# EAGLE design Opener (EAGLE 7.1.0)
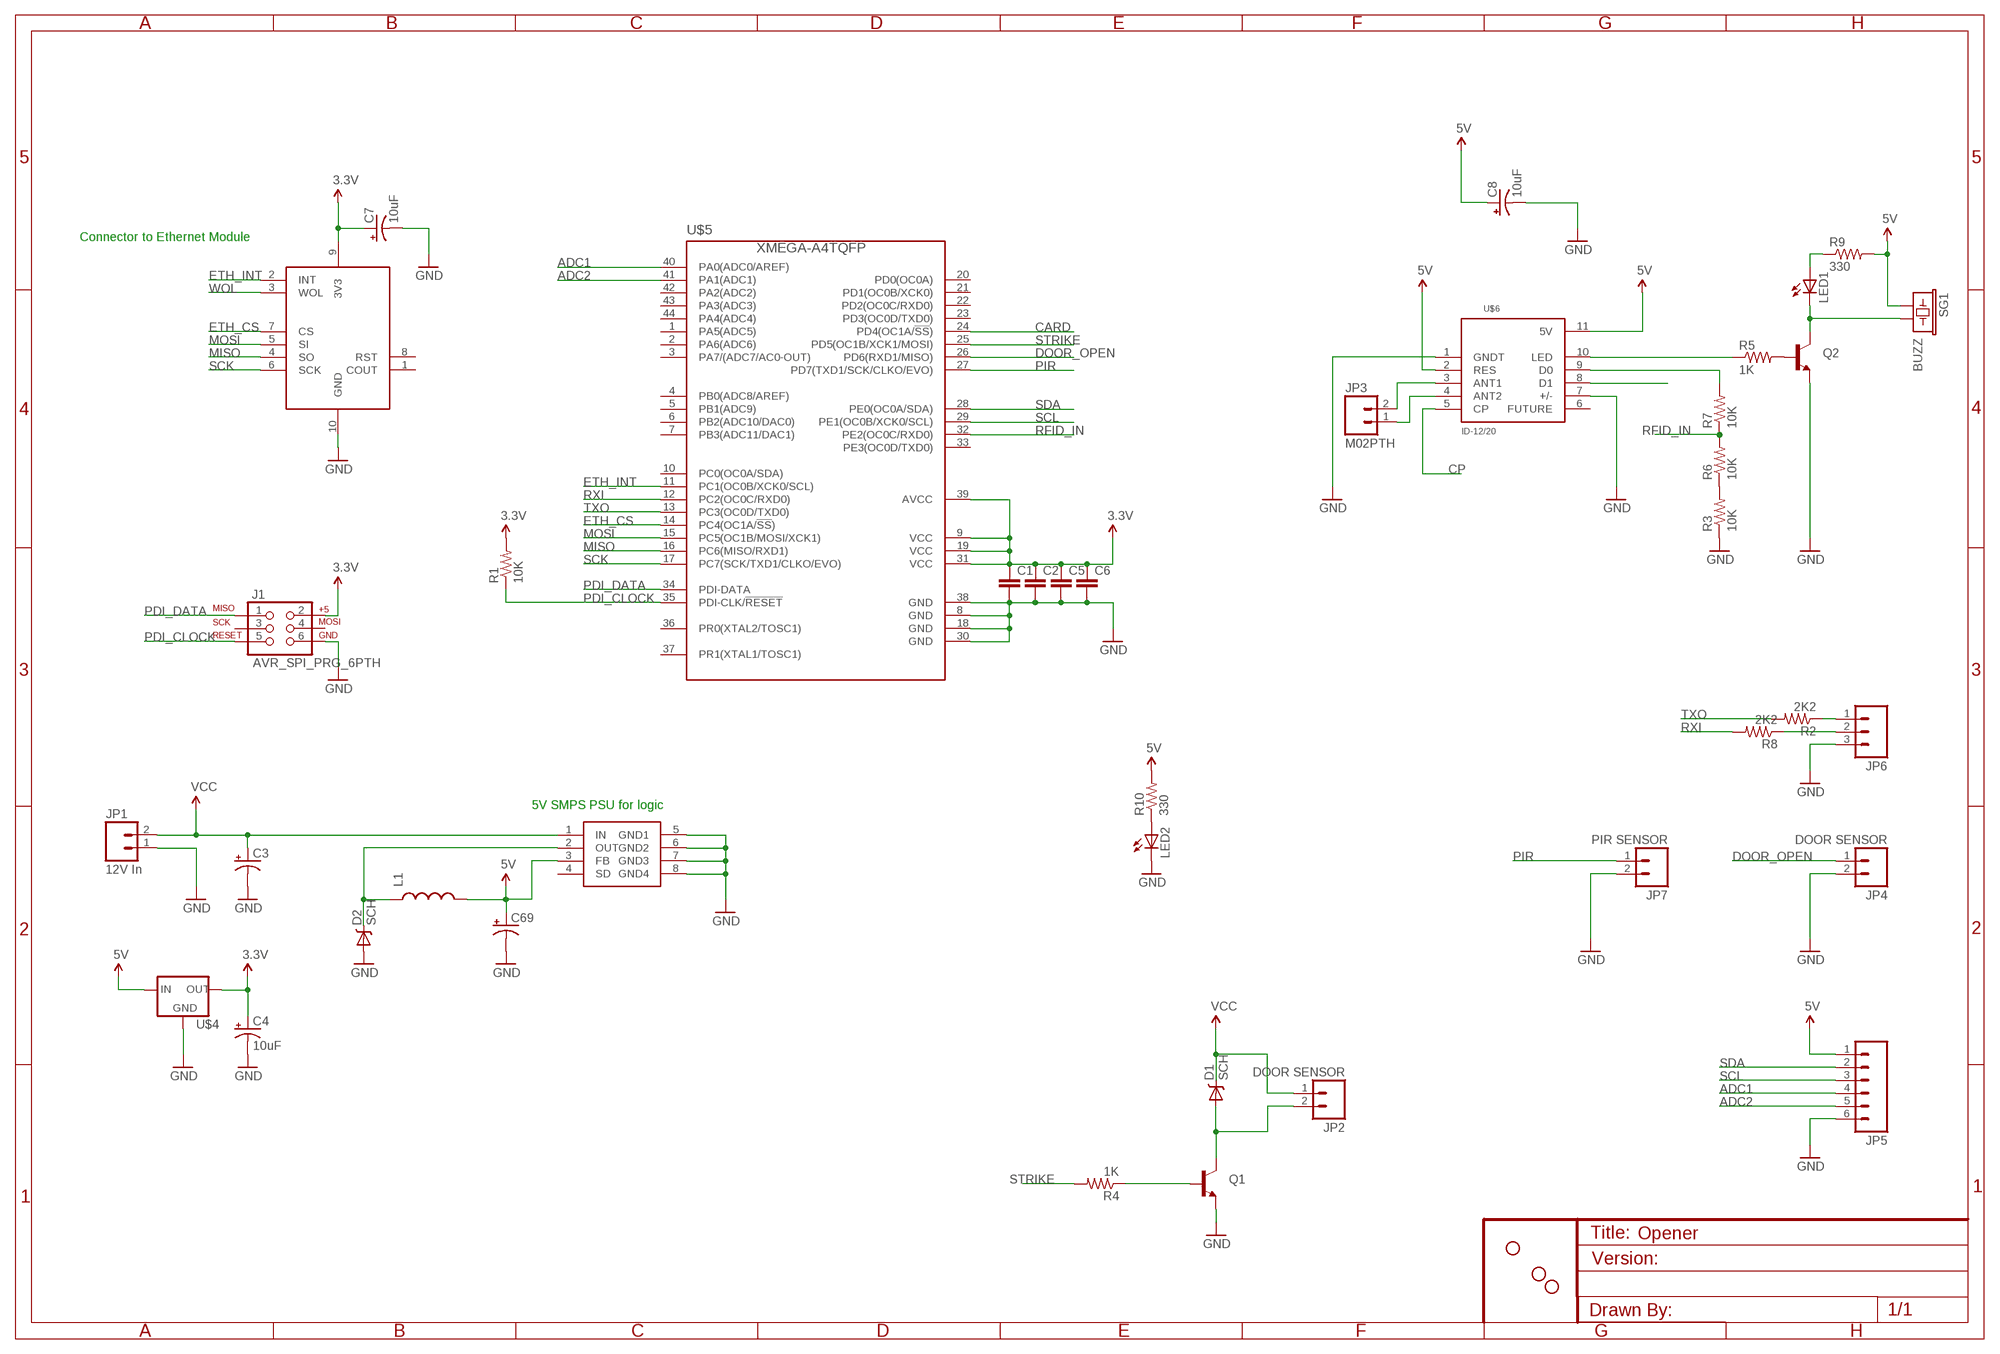
[diagram p0: schematic, sheet 1]

## Parts
C1  CAP0603-CAP  [0603-CAP]
C2  CAP0603-CAP  [0603-CAP]
C3  CAP_POLPTH1  [CPOL-RADIAL-100UF-25V]
C4  10uF  CAP_POL1206  [EIA3216]
C5  CAP0603-CAP  [0603-CAP]
C6  CAP0603-CAP  [0603-CAP]
C7  10uF  CAP_POL1206  [EIA3216]
C8  10uF  CAP_POL1206  [EIA3216]
C69  CAP_POLPTH1  [CPOL-RADIAL-100UF-25V]
D1  SCH  DIODE-SCHOTTKY_  [SMA-DIODE]
D2  SCH  DIODE-SCHOTTKY_  [SMA-DIODE]
J1  AVR_SPI_PRG_6PTH  [2X3]
JP1  12V In  M023.5MM  [SCREWTERMINAL-3.5MM-2]
JP2  DOOR SENSOR  M02POLAR  [MOLEX-1X2]
JP3  M02PTH  [1X02]
JP4  DOOR SENSOR  M02POLAR  [MOLEX-1X2]
JP5  M06SIP  [1X06]
JP6  M03PTH  [1X03]
JP7  PIR SENSOR  M02POLAR  [MOLEX-1X2]
L1  INDUCTOR1206H*  [INDUCTOR-1206]
LED1  LED-FKIT-1206  [FKIT-LED-1206]
LED2  LED-FKIT-1206  [FKIT-LED-1206]
Q1  TRANSISTOR_NPNTO92  [TO-92]
Q2  TRANSISTOR_NPNSOT23  [SOT23]
R1  10K  RESISTOR1206  [1206]
R2  2K2  RESISTOR1206  [1206]
R3  10K  RESISTOR1206  [1206]
R4  1K  RESISTOR1206  [1206]
R5  1K  RESISTOR1206  [1206]
R6  10K  RESISTOR1206  [1206]
R7  10K  RESISTOR1206  [1206]
R8  2K2  RESISTOR1206  [1206]
R9  330  RESISTOR1206  [1206]
R10  330  RESISTOR1206  [1206]
SG1  BUZZ  BUZZERSMD2  [BUZZER-CCV]
STANDOFF1  STAND-OFF  [STAND-OFF]
STANDOFF3  STAND-OFF  [STAND-OFF]
STANDOFF4  STAND-OFF  [STAND-OFF]
U$1  ETHMODULE  [2X5]
U$3  AP1509-33  [SOIC-8]
U$4  V_REG_MIC2920  [SOT223]
U$5  XMEGA-A4TQFP  [TQFP44]
U$6  ID-12/20  [ID-12]

## Nets
3.3V: C1.1 C2.1 C4.A(+) C5.1 C6.1 C7.A(+) J1.2 R1.2 U$1.9(3V3) U$4.3(OUT) U$5.9(VCC) U$5.19(VCC) U$5.31(VCC) U$5.39(AVCC)
5V: C8.A(+) C69.1(+) JP5.1 L1.P$2 R9.2 R10.2 SG1.+ U$3.3(FB) U$4.1(IN) U$6.2(RES) U$6.11(5V)
ADC1: JP5.4 U$5.40(PA0(ADC0/AREF))
ADC2: JP5.5 U$5.41(PA1(ADC1))
CARD: U$5.24(PD4(OC1A/!SS!))
CP: U$6.5(CP)
DOOR_OPEN: JP4.1 U$5.26(PD6(RXD1/MISO))
ETH_CS: U$1.7(CS) U$5.14(PC4(OC1A/!SS!))
ETH_INT: U$1.2(INT) U$5.11(PC1(OC0B/XCK0/SCL))
GND: C1.2 C2.2 C3.2(-) C4.C(-) C5.2 C6.2 C7.C(-) C8.C(-) C69.2(-) D2.A J1.6 JP1.1 JP4.2 JP5.6 JP6.3 JP7.2 LED2.C Q1.1(E) Q2.2(E) R3.1 U$1.10(GND) U$3.5(GND1) U$3.6(GND2) U$3.7(GND3) U$3.8(GND4) U$4.2(GND) U$5.8(GND) U$5.18(GND) U$5.30(GND) U$5.38(GND) U$6.1(GNDT) U$6.7(+/-)
MISO: U$1.4(SO) U$5.16(PC6(MISO/RXD1))
MOSI: U$1.5(SI) U$5.15(PC5(OC1B/MOSI/XCK1))
N$1: Q1.2(B) R4.1
N$2: JP3.2 U$6.3(ANT1)
N$3: D2.C L1.P$1 U$3.2(OUT)
N$4: R7.2 U$6.9(D0)
N$5: R3.2 R6.1
N$6: JP3.1 U$6.4(ANT2)
N$7: D1.A JP2.2 Q1.3(C)
N$8: R5.1 U$6.10(LED)
N$9: Q2.1(B) R5.2
N$10: LED1.C Q2.3(C) SG1.-
N$11: LED1.A R9.1
N$12: JP6.1 R2.1
N$13: U$6.8(D1)
N$14: LED2.A R10.1
N$17: JP6.2 R8.1
PDI_CLOCK: J1.5 R1.1 U$5.35(PDI-CLK/!RESET)
PDI_DATA: J1.1 U$5.34(PDI-DATA)
PIR: JP7.1 U$5.27(PD7(TXD1/SCK/CLKO/EVO))
RFID_IN: R6.2 R7.1 U$5.32(PE2(OC0C/RXD0))
RXI: R8.2 U$5.12(PC2(OC0C/RXD0))
SCK: U$1.6(SCK) U$5.17(PC7(SCK/TXD1/CLKO/EVO))
SCL: JP5.3 U$5.29(PE1(OC0B/XCK0/SCL))
SDA: JP5.2 U$5.28(PE0(OC0A/SDA))
STRIKE: R4.2 U$5.25(PD5(OC1B/XCK1/MOSI))
TXO: R2.2 U$5.13(PC3(OC0D/TXD0))
VCC: C3.1(+) D1.C JP1.2 JP2.1 U$3.1(IN)
WOL: U$1.3(WOL)
Unconnected: J1.3 J1.4 U$3.4(SD) U$5.1(PA5(ADC5)) U$5.2(PA6(ADC6)) U$5.3(PA7/(ADC7/AC0-OUT)) U$5.4(PB0(ADC8/AREF)) U$5.5(PB1(ADC9)) U$5.6(PB2(ADC10/DAC0)) U$5.7(PB3(ADC11/DAC1)) U$5.10(PC0(OC0A/SDA)) U$5.20(PD0(OC0A)) U$5.21(PD1(OC0B/XCK0)) U$5.22(PD2(OC0C/RXD0)) U$5.23(PD3(OC0D/TXD0)) U$5.33(PE3(OC0D/TXD0)) U$5.36(PR0(XTAL2/TOSC1)) U$5.37(PR1(XTAL1/TOSC1)) U$5.42(PA2(ADC2)) U$5.43(PA3(ADC3)) U$5.44(PA4(ADC4)) U$6.6(FUTURE)

## Notes on the sheet
- Connector to Ethernet Module
- 5V SMPS PSU for logic

## Power pins joined to a net without a drawn wire
COUT: U$1.1(COUT)
RST: U$1.8(RST)

## Library data of the parts
C1 C2 C5 C6 = 1_SparkFun-Capacitors:CAP: Capacitor Standard 0603 ceramic capacitor, and 0.1" leaded capacitor.
C3 C4 C7 C8 C69 = 1_SparkFun-Capacitors:CAP_POL: Capacitor Polarized These are standard SMD and PTH capacitors. Normally 10uF, 47uF, and 100uF in electrolytic and tantalum varieties. Always verify the external diameter of the through hole cap, it varies with capacity, voltage, and manufacturer. The EIA devices should be standard.
D1 D2 = 1_SparkFun-DiscreteSemi:DIODE-SCHOTTKY: Commonly MBRA140.
J1 = 1_SparkFun-Connectors:AVR_SPI_PRG_6: AVR ISP 6 Pin This is the reduced ISP connector for AVR programming. Common on Arduino. This footprint will take up less PCB space and can be used with a 10-pin to 6-pin adapter such as SKU: BOB-08508
JP1-JP4 JP7 = 1_SparkFun-Connectors:M02: Standard 2-pin 0.1" header. Use with - straight break away headers ( PRT-00116) - right angle break away headers (PRT-00553) - swiss pins (PRT-00743) - machine pins (PRT-00117) - female headers (PRT-00115) Molex polarized connector foot print use with: PRT-08233 with associated crimp pins and housings. 2.54_SCREWTERM for use with PRT-10571. 3.5mm Screw Terminal footprints for PRT-08084 5mm Screw Terminal footprints for use with PRT-08433
JP5 = 1_SparkFun-Connectors:M06: Header 6 Standard 6-pin 0.1" header. Use with straight break away headers (SKU : PRT-00116), right angle break away headers (PRT-00553), swiss pins (PRT-00743), machine pins (PRT-00117), and female headers (PRT-00115). Molex polarized connector foot print use with SKU : PRT-08094 with associated crimp pins and housings. NOTES ON THE VARIANTS LOCK and LOCK_LONGPADS... This footprint was designed to help hold the alignment of a through-hole component (i.e. 6-pin header) while soldering it into place. You may notice that each hole has been shifted either up or down by 0.005 of an inch from it's more standard position (which is a perfectly straight line). This slight alteration caused the pins (the squares in the middle) to touch the edges of the holes. Because they are alternating, it causes a "brace" to hold the component in place. 0.005 has proven to be the perfect amount of "off-center" position when using our standard breakaway headers. Although looks a little odd when you look at the bare footprint, once you have a header in there, the alteration is very hard to notice. Also,if you push a header all the way into place, it is covered up entirely on the bottom side. This idea of altering the position of holes to aid alignment will be further integrated into the Sparkfun Library for other footprints. It can help hold any component with 3 or more connection pins.
JP6 = 1_SparkFun-Connectors:M03: Header 3 Standard 3-pin 0.1" header. Use with straight break away headers (SKU : PRT-00116), right angle break away headers (PRT-00553), swiss pins (PRT-00743), machine pins (PRT-00117), and female headers (PRT-00115). Molex polarized connector foot print use with SKU : PRT-08232 with associated crimp pins and housings.
L1 = 1_SparkFun-Passives:INDUCTOR: Inductors Basic Inductor/Choke - 0603 and 1206. Footprints are not proven and vary greatly between part numbers. SRN6045- 33uH, 20% 1.4A SDR0403-560KL - 56uH, 10%, 500mA RMS/740mA peak
LED1 LED2 = 1_SparkFun-LED:LED: LEDs Standard schematic elements and footprints for 5mm, 3mm, 1206, and 0603 sized LEDs. 5mm - Spark Fun Electronics SKU : COM-00529 (and others)
Q1 Q2 = 1_SparkFun-DiscreteSemi:TRANSISTOR_NPN: Generic NPN BJT MMBT2222A - TRANS-08049 (SOT-23, 1A 40V) MPSA42 - TRANS-09116 (SOT-23, 500mA 300V) MMBT5088LT1G - TRANS-11160 (SOT-23, 50 mA 30V)
R1-R10 = 1_SparkFun-Resistors:RESISTOR: Resistor Basic schematic elements and footprints for 0603, 1206, and PTH resistors.
SG1 = 1_SparkFun-Electromechanical:BUZZER: Buzzer 12mm Spark Fun Electronics SKU : Comp-Buzzer
STANDOFF1 STANDOFF3 STANDOFF4 = 1_SparkFun-Electromechanical:STAND-OFF: #4 Stand Off This is the mechanical footprint for a #4 phillips button head screw. Use the keepout ring to avoid running the screw head into surrounding components. SKU : PRT-00447
U$1 = 0_Tristan's_Lib:ETHMODULE
U$3 = 0_Tristan's_Lib:AP1509-33
U$4 = 1_SparkFun-PowerIC:V_REG_MIC2920: MIC2920A (http://www.micrel.com/_PDF/mic2920.pdf) - 400mA output LDO Regulator
U$5 = avr-7:XMEGA-A4: Atmel XMega A4 series processor
U$6 = 1_SparkFun-RF:ID-12/20: RFID reader for ID2, ID12, and ID20 Package

## Board
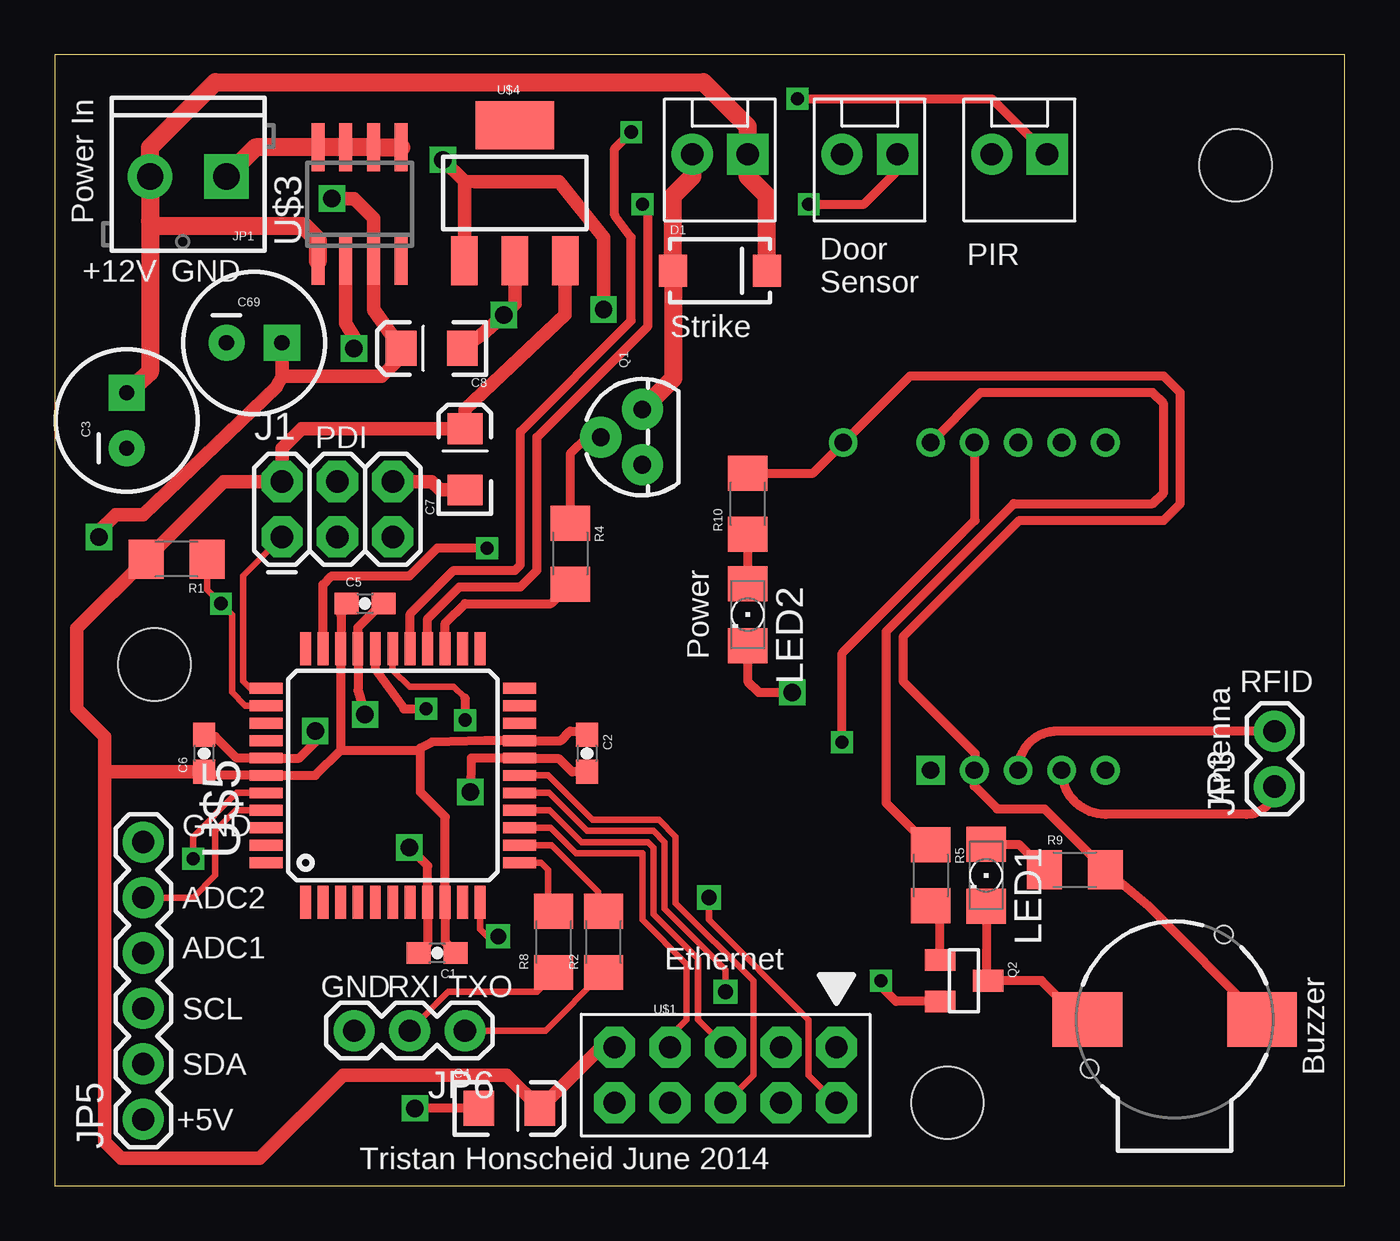
[diagram p1: board, top side]
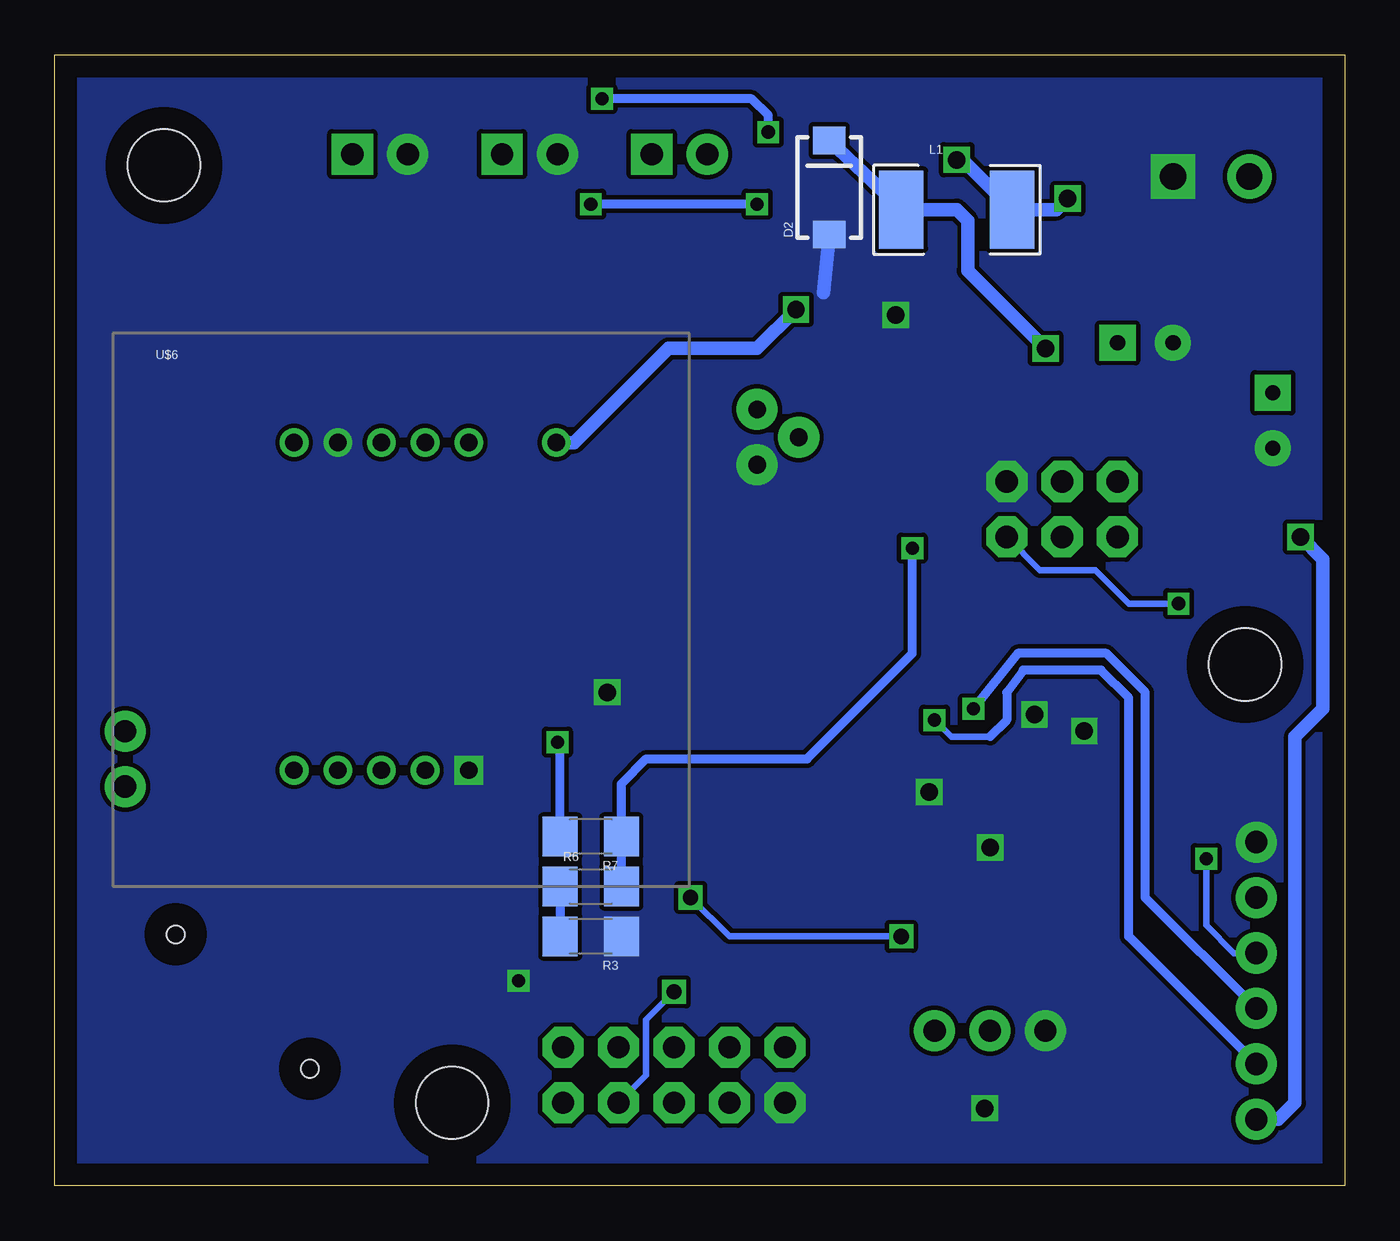
[diagram p2: board, bottom side, seen from below]

Size 59.11 x 51.81 mm. Coordinates in mm from the lower left corner, seen from the top.
Outline: 0,0 59.11,0 59.11,51.81 0,51.81 0,0
Copper layers (1*16): Top 0.035mm / dielectric 1.5mm / Bottom 0.035mm
Design rules "default": minimum track width 10mil, minimum drill 24mil, track to track 8mil, track to pad 8mil, pad to pad 8mil, via to via 8mil, smd to smd 8mil, copper to edge 40mil, drill to drill 8mil, minimum pad ring 10mil, minimum via ring 8mil, stop-mask expansion 4mil, vias tented up to drill 0mil, thermal gap 10mil

### Footprints (pad centres in the part's own frame; a part is rotated, then mirrored left to right if it is on the bottom)
0603-CAP = smd 1.1 x 1: 1 -0.85,0; 2 0.85,0
CPOL-RADIAL-100UF-25V = drill 0.7 pad 1.651 square: 1 1.27,0 | drill 0.7 pad 1.651: 2 -1.27,0
EIA3216 = smd 1.4 x 1.6: A 1.4,0; C -1.4,0
SMA-DIODE = smd 1.27 x 1.47: A -2.15,0; C 2.15,0
2X3 = drill 1.016 pad 1.88 octagon: 1 0,0; 2 0,2.54; 3 2.54,0; 4 2.54,2.54; 5 5.08,0; 6 5.08,2.54
SCREWTERMINAL-3.5MM-2 = drill 1.2 pad 2.032 square: 1 0,0 | drill 1.2 pad 2.032: 2 3.5,0
MOLEX-1X2 = drill 1.016 pad 1.88 square: 1 0,0 | drill 1.016 pad 1.88: 2 2.54,0
1X02 = drill 1.016 pad 1.88: 1 0,0; 2 2.54,0
1X06 = drill 1.016 pad 1.88: 1 0,0; 2 2.54,0; 3 5.08,0; 4 7.62,0; 5 10.16,0; 6 12.7,0
1X03 = drill 1.016 pad 1.88: 1 0,0; 2 2.54,0; 3 5.08,0
INDUCTOR-1206 = smd 2.032 x 3.556: P$1 -2.54,0; P$2 2.54,0
FKIT-LED-1206 = smd 1.6 x 1.803: A -1.422,0; C 1.422,0
TO-92 = drill 0.813 pad 1.88: 1 -1.27,0; 2 0,1.905; 3 1.27,0
SOT23 = smd 1 x 1.4: 1 -0.95,-1.1; 2 0.95,-1.1; 3 0,1.1
1206 = smd 1.6 x 1.8: 1 -1.4,0; 2 1.4,0
BUZZER-CCV = smd 3.2 x 2.5: + 4,0; - -4,0 | hole 0.8: -3.9,-2.25; 2.25,3.9
STAND-OFF = hole 3.302: 0,0
2X5 = drill 1.016 pad 1.88 octagon: 1 -1.27,5.08; 2 1.27,5.08; 3 -1.27,2.54; 4 1.27,2.54; 5 -1.27,0; 6 1.27,0; 7 -1.27,-2.54; 8 1.27,-2.54; 9 -1.27,-5.08; 10 1.27,-5.08
SOIC-8 = smd 0.6 x 2.2: 1 -1.905,-2.6; 2 -0.635,-2.6; 3 0.635,-2.6; 4 1.905,-2.6; 5 1.905,2.6; 6 0.635,2.6; 7 -0.635,2.6; 8 -1.905,2.6
SOT223 = smd 1.219 x 2.235: 1 -2.311,-3.099; 2 0,-3.099; 3 2.311,-3.099 | smd 3.6 x 2.2: 4 0,3.099
TQFP44 = smd 1.5 x 0.5: 1 -5.8,4; 2 -5.8,3.2; 3 -5.8,2.4; 4 -5.8,1.6; 5 -5.8,0.8; 6 -5.8,0; 7 -5.8,-0.8; 8 -5.8,-1.6; 9 -5.8,-2.4; 10 -5.8,-3.2; 11 -5.8,-4; 23 5.8,-4; 24 5.8,-3.2; 25 5.8,-2.4; 26 5.8,-1.6; 27 5.8,-0.8; 28 5.8,0; 29 5.8,0.8; 30 5.8,1.6; 31 5.8,2.4; 32 5.8,3.2; 33 5.8,4 | smd 0.5 x 1.5: 12 -4,-5.8; 13 -3.2,-5.8; 14 -2.4,-5.8; 15 -1.6,-5.8; 16 -0.8,-5.8; 17 0,-5.8; 18 0.8,-5.8; 19 1.6,-5.8; 20 2.4,-5.8; 21 3.2,-5.8; 22 4,-5.8; 34 4,5.8; 35 3.2,5.8; 36 2.4,5.8; 37 1.6,5.8; 38 0.8,5.8; 39 0,5.8; 40 -0.8,5.8; 41 -1.6,5.8; 42 -2.4,5.8; 43 -3.2,5.8; 44 -4,5.8
ID-12 = drill 0.8 square: 1 16.255,5.32 | drill 0.8: 2 14.255,5.32; 3 12.255,5.32; 4 10.255,5.32; 5 8.255,5.32; 6 8.255,20.32; 7 10.255,20.32; 8 12.255,20.32; 9 14.255,20.32; 10 16.255,20.32; 11 20.255,20.32

### Placement (x,y rotation side)
C1  17.53,10.67 180 top
C2  24.38,19.81 270 top
C3  3.3,35.05 90 top
C4  20.83,3.56 0 top
C5  14.22,26.67 0 top
C6  6.86,19.81 90 top
C7  18.8,33.27 90 top
C8  17.27,38.35 180 top
C69  9.14,38.61 0 top
D1  30.48,41.91 0 top
D2  23.62,45.72 90 bottom
J1  10.41,29.72 0 top
JP1  7.87,46.23 180 top
JP2  31.75,47.24 180 top
JP3  55.88,18.29 90 top
JP4  38.61,47.24 180 top
JP5  4.06,3.05 90 top
JP6  18.8,7.11 180 top
JP7  45.47,47.24 180 top
L1  17.78,44.7 0 bottom
LED1  42.67,14.22 270 top
LED2  31.75,26.16 270 top
Q1  26.92,34.29 90 top
Q2  41.66,9.4 270 top
R1  5.59,28.7 180 top
R2  25.15,11.18 90 top
R3  34.54,11.43 180 bottom
R4  23.62,28.96 270 top
R5  40.13,14.22 270 top
R6  34.54,13.72 0 bottom
R7  34.54,16 180 bottom
R8  22.86,11.18 90 top
R9  46.74,14.48 0 top
R10  31.75,31.24 90 top
SG1  51.31,7.62 0 top
STANDOFF1  4.57,23.88 0 top
STANDOFF3  54.1,46.74 0 top
STANDOFF4  40.89,3.81 0 top
U$1  30.73,5.08 270 top
U$3  13.97,44.96 0 top
U$4  21.08,45.47 0 top
U$5  15.49,18.8 90 top
U$6  56.39,13.72 0 bottom

### Tracks (layer width: path | path; a pad name or v marks a point on that pad's centre or on a via)
3.3V
  Top 0.406: C6.1 7.02,18.8 U$5.39 11.94,18.8 13.09,19.95 | 13.09,19.95 U$5.31 13.12,26.15 C5.1 | 16.76,20.07 16.76,18.03 17.89,16.9 U$5.9 17.89,11.15 C1.1 | 16.76,20.07 17.27,20.32 19.74,20.4 U$5.19 23.19,20.4 23.62,20.83 24.04,20.83 C2.1 | 13.09,19.95 16.65,19.95 16.76,20.07
  Top 0.61: U$4.3 23.39,39.9 18.8,35.56 C7.A 11.31,34.67 10.41,33.78 J1.2 7.74,32.26 R1.2 1.02,25.53 1.02,21.84 2.29,20.57 2.29,19.05 | U$1.9 25.02,6.35 C4.A 20.7,5.08 13.21,5.08 9.4,1.27 3.05,1.27 2.29,2.03 2.29,19.05 | C6.1 2.37,18.96 2.29,19.05
5V  (via drill 0.8)
  Top 0.406: SG1.+ 50.1,12.82 R9.2 45.34,17.27 43.18,17.27 42.13,18.32 U$6.2 42.16,19.07 42.16,19.81 38.86,23.11 38.86,25.15 44.2,30.48 50.8,30.48 51.56,31.24 51.56,36.32 50.8,37.08 39.18,37.08 U$6.11 34.74,32.64 R10.2
  Top 0.61: 10.41,37.08 14.99,37.08 15.87,37.97 C8.A 14.61,40.13 U$3.3 14.61,44.32 13.72,45.21 v12.7,45.21 | U$4.1 18.77,46 | 18.77,46 v17.78,46.99 | 18.77,46 19.25,45.97 23.11,45.97 25.15,43.43 v25.15,40.13 | v2.03,29.72 2.03,29.97 2.79,30.73 4.06,30.73 10.16,36.58 10.41,37.08 | 10.41,37.08 C69.1
  Bottom 0.61: v12.7,45.21 13.21,44.7 L1.P$2 17.53,46.99 v17.78,46.99 | JP5.1 3.05,3.05 2.29,3.81 2.29,20.57 1.02,21.84 1.02,28.7 v2.03,29.72 | U$6.11 35.31,34.04 30.99,38.35 26.92,38.35 v25.15,40.13
ADC1  (via drill 0.6)
  Top 0.305: U$5.40 8.34,18 6.35,16 v6.35,14.99
  Bottom 0.305: v6.35,14.99 6.35,11.94 5.08,10.67 JP5.4
ADC2
  Top 0.305: U$5.41 8.31,17.2 7.37,16.26 7.37,14.22 6.35,13.21 JP5.5
DOOR_OPEN  (via drill 0.6)
  Top 0.406: U$5.26 17.09,25.98 18.54,27.43 21.34,27.43 22.1,28.19 22.1,34.29 27.18,39.37 27.18,44.7 v26.92,44.96 | v34.54,44.96 37.08,44.96 38.61,46.48 JP4.1
  Bottom 0.406: v26.92,44.96 v34.54,44.96
ETH_CS
  Top 0.305: U$5.14 22.72,16.4 23.88,15.24 26.92,15.24 26.92,12.19 28.96,10.16 28.96,7.62 28.19,6.86 U$1.7
ETH_INT  (via drill 0.7)
  Top 0.305: U$5.11 19.49,11.75 19.81,11.43 v20.32,11.43 | v29.97,13.21 29.97,12.19 34.54,7.62 34.54,5.08 U$1.2
  Bottom 0.305: v20.32,11.43 28.19,11.43 v29.97,13.21
GND  (via drill 0.6, 0.8)
  Top 0.406: C6.2 6.95,20.57 7.37,20.57 8.34,19.6 U$5.38 11.21,19.6 11.94,20.32 v11.94,20.83 | v19.05,18.03 19.09,19.6 U$5.18 21.33,19.56 23.11,19.56 23.71,18.96 C2.2 | v14.22,21.59 13.89,22.68 U$5.30 13.89,25.58 14.73,26.42 14.73,26.58 C5.2 | v16.26,15.49 17.09,14.66 U$5.8 17.09,11.09 C1.2 | C4.C v16.51,3.56 | Q2.2 38.54,8.45 37.85,9.14 v37.85,9.4 | LED2.C 31.75,23.11 32.26,22.61 v33.78,22.61
  Top 0.61: U$4.2 21.08,40.39 v20.57,39.88 19.56,38.99 C8.C | C7.C 17.66,31.87 17.27,32.26 J1.6
  Top 0.813: U$3.5 U$3.6 U$3.7 U$3.8 9.2,47.56 JP1.1
  Bottom 0.61: D2.A 23.88,40.89 | v20.57,39.88 20.89,40.07
  pour Bottom (no thermals): 0.51,50.55 58.67,50.55 58.67,0.25 0.51,0.25
MISO  (via drill 0.7)
  Top 0.305: U$5.16 22.64,18 24.38,16.26 27.43,16.26 27.94,15.75 27.94,12.7 30.73,9.91 v30.73,8.89
  Bottom 0.305: v30.73,8.89 32,7.62 32,5.08 U$1.4
MOSI
  Top 0.305: U$5.15 22.68,17.2 24.13,15.75 27.18,15.75 27.43,15.49 27.43,12.45 29.46,10.41 29.46,7.62 U$1.5
N$1
  Top 0.406: Q1.2 24.38,34.29 23.62,33.53 R4.1
N$2
  Top 0.406: JP3.2 45.92,20.83 arc90 U$6.3
N$3  (via drill 0.8)
  Top 0.61: v13.72,38.35 13.72,38.86 13.34,39.5 U$3.2
  Bottom 0.61: D2.C 21.2,45.58 L1.P$1 17.78,44.7 17.27,44.2 17.27,41.91 v13.72,38.35
N$4  (via drill 0.6)
  Top 0.406: v36.07,20.32 36.07,24.38 42.16,30.48 42.16,34.01 U$6.9
  Bottom 0.406: R7.2 35.94,20.2 v36.07,20.32
N$5
  Bottom 0.406: R6.1 R3.2
N$6
  Top 0.406: JP3.1 arc-90 54.61,17.02 48.15,17.02 arc-90 U$6.4
N$7
  Top 0.813: JP2.2 29.21,46.23 28.33,45.35 D1.A 28.33,36.97 Q1.3
N$8
  Top 0.406: R5.1 40,15.62 38.1,17.53 38.1,25.4 43.94,31.24 50.29,31.24 50.8,31.75 50.8,35.81 50.29,36.32 42.42,36.32 U$6.10
N$9
  Top 0.406: Q2.1 40.56,12.4 R5.2
N$10
  Top 0.406: SG1.- 46.99,7.62 45.21,9.4 Q2.3 42.67,9.48 LED1.C
N$11
  Top 0.406: LED1.A 44.17,15.65 R9.1
N$12
  Top 0.305: JP6.1 22.48,7.11 R2.1
N$14
  Top 0.406: R10.1 LED2.A
N$17
  Top 0.305: R8.1 22.98,9.78 22.1,8.89 18.03,8.89 JP6.2
PDI_CLOCK  (via drill 0.6)
  Top 0.305: U$5.35 8.74,22 8.13,22.61 8.13,26.16 v7.62,26.67 6.99,27.3 R1.1
  Bottom 0.305: v7.62,26.67 9.91,26.67 11.43,28.19 13.97,28.19 J1.5
PDI_DATA
  Top 0.305: U$5.34 8.95,22.8 8.64,23.11 8.64,27.94 J1.1
PIR  (via drill 0.6)
  Top 0.406: U$5.27 16.29,26.2 18.29,28.19 21.08,28.19 21.34,28.45 21.34,34.54 26.42,39.62 26.42,43.43 25.65,44.45 25.65,47.5 v26.42,48.26 | v34.04,49.78 42.93,49.78 JP7.1
  Bottom 0.406: v26.42,48.26 26.42,49.02 27.18,49.78 v34.04,49.78
RFID_IN  (via drill 0.6)
  Top 0.406: v19.81,29.21 17.53,29.21 16.26,27.94 12.7,27.94 12.29,27.53 U$5.32
  Bottom 0.406: R6.2 R7.1 33.14,18.42 32,19.56 24.64,19.56 19.81,24.38 v19.81,29.21
RXI
  Top 0.305: U$5.12 22.29,14.8 22.61,14.48 22.61,12.83 R8.2
SCK
  Top 0.305: U$5.17 22.61,18.8 24.64,16.76 27.69,16.76 28.45,16 28.45,12.95 32,9.4 32,5.08 U$1.6
SCL  (via drill 0.6)
  Top 0.406: U$5.29 14.69,23.66 16,21.84 v17.02,21.84
  Bottom 0.406: JP5.3 9.14,13.21 9.14,22.61 10.92,24.38 14.99,24.38 v17.02,21.84
SDA  (via drill 0.6)
  Top 0.305: U$5.28 15.49,23.62 16.26,22.86 18.29,22.86 18.8,22.35
  Top 0.406: U$5.28 15.54,24.6 | 18.8,22.35 v18.8,21.34
  Bottom 0.305: 16.26,20.57 18.03,20.57 v18.8,21.34
  Bottom 0.406: JP5.2 9.91,11.43 9.91,22.35 11.18,23.62 14.73,23.62 15.49,22.61 15.49,21.34 16.26,20.57
STRIKE
  Top 0.406: U$5.25 17.89,25.77 18.8,26.67 22.74,26.67 R4.2
TXO
  Top 0.305: U$5.13 22.76,15.6 24.89,13.46 24.89,12.83 R2.2
VCC
  Top 0.813: 4.37,44.2 JP1.2 4.37,47.55 7.37,50.55 29.72,50.55 31.75,48.51 JP2.1 31.75,46.23 32.63,45.35 D1.C | 4.37,44.2 4.37,37.28 C3.1 | U$3.1 12.06,43.31 11.43,43.94 4.63,43.94 4.37,44.2

### Text on the board
tPlace: Power In | PIR | +12V | GND | Door / Sensor | Strike | PDI | Power | RFID | Antenna | GND | ADC2 | ADC1 | Ethernet | GND | RXI | TXO | SCL | SDA | Buzzer | +5V | Tristan Honscheid June 2014